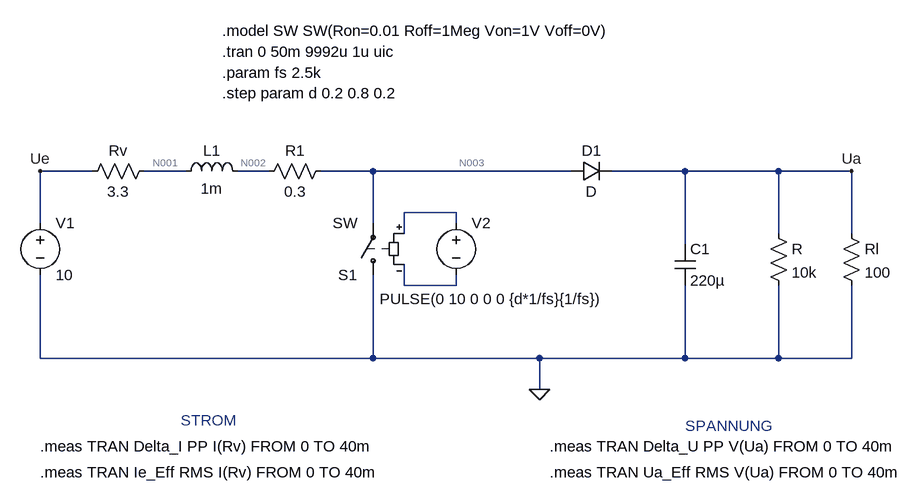
[diagram p0: schematic C4 HSS 1.asc]
C4 HSS 1.asc, the LTspice schematic file:
Version 4.1
SHEET 1 1840 920
WIRE -240 64 -320 64
WIRE -96 64 -160 64
WIRE 32 64 -16 64
WIRE 192 64 112 64
WIRE 496 64 192 64
WIRE 672 64 560 64
WIRE 816 64 672 64
WIRE 928 64 816 64
WIRE 320 128 240 128
WIRE -320 144 -320 64
WIRE 192 144 192 64
WIRE 320 144 320 128
WIRE 240 160 240 128
WIRE 816 160 816 64
WIRE 928 160 928 64
WIRE 672 176 672 64
WIRE 240 240 240 208
WIRE 320 240 320 224
WIRE 320 240 240 240
WIRE -320 352 -320 224
WIRE 192 352 192 224
WIRE 192 352 -320 352
WIRE 448 352 192 352
WIRE 672 352 672 240
WIRE 672 352 448 352
WIRE 816 352 816 240
WIRE 816 352 672 352
WIRE 928 352 928 240
WIRE 928 352 816 352
WIRE 448 400 448 352
FLAG -320 64 Ue
FLAG 928 64 Ua
FLAG 448 400 0
SYMBOL voltage -320 128 R0
SYMATTR InstName V1
SYMATTR Value 10
SYMBOL ind -112 80 R270
WINDOW 0 32 56 VTop 2
WINDOW 3 5 56 VBottom 2
SYMATTR InstName L1
SYMATTR Value 1m
SYMBOL diode 496 80 R270
WINDOW 0 32 32 VTop 2
WINDOW 3 0 32 VBottom 2
SYMATTR InstName D1
SYMBOL cap 656 176 R0
SYMATTR InstName C1
SYMATTR Value 220µ
SYMBOL res 912 144 R0
SYMATTR InstName Rl
SYMATTR Value 100
SYMBOL voltage 320 128 R0
WINDOW 3 -118 133 Left 2
SYMATTR Value PULSE(0 10 0 0 0 {d*1/fs}{1/fs})
SYMATTR InstName V2
SYMBOL sw 192 240 R180
SYMATTR InstName S1
SYMBOL res 800 144 R0
SYMATTR InstName R
SYMATTR Value 10k
SYMBOL res -144 48 R90
WINDOW 0 0 56 VBottom 2
WINDOW 3 32 56 VTop 2
SYMATTR InstName Rv
SYMATTR Value 3.3
SYMBOL res 128 48 R90
WINDOW 0 0 56 VBottom 2
WINDOW 3 32 56 VTop 2
SYMATTR InstName R1
SYMATTR Value 0.3
TEXT -40 -88 Left 2 !.param fs 2.5k
TEXT -40 -56 Left 2 !.step param d 0.2 0.8 0.2
TEXT -40 -152 Left 2 !.model SW SW(Ron=0.01 Roff=1Meg Von=1V Voff=0V)
TEXT -40 -120 Left 2 !.tran 0 50m 9992u 1u uic
TEXT -320 488 Left 2 !.meas TRAN Delta_I PP I(Rv) FROM 0 TO 40m
TEXT -320 528 Left 2 !.meas TRAN Ie_Eff RMS I(Rv) FROM 0 TO 40m
TEXT 464 488 Left 2 !.meas TRAN Delta_U PP V(Ua) FROM 0 TO 40m
TEXT 464 528 Left 2 !.meas TRAN Ua_Eff RMS V(Ua) FROM 0 TO 40m
TEXT -104 448 Left 2 ;STROM
TEXT 672 456 Left 2 ;SPANNUNG

The netlist it stands for:
* C4 HSS 1.asc
V1 Ue 0 10
L1 N001 N002 1m
D1 N003 Ua D
C1 Ua 0 220µ
Rl Ua 0 100
V2 N004 N005 PULSE(0 10 0 0 0 {d*1/fs}{1/fs})
S1 0 N003 N004 N005 SW
R Ua 0 10k
Rv N001 Ue 3.3
R1 N003 N002 0.3
.model D D
.lib standard.dio
.param fs 2.5k
.step param d 0.2 0.8 0.2
.model SW SW(Ron=0.01 Roff=1Meg Von=1V Voff=0V)
.tran 0 50m 9992u 1u uic
.meas TRAN Delta_I PP I(Rv) FROM 0 TO 40m
.meas TRAN Ie_Eff RMS I(Rv) FROM 0 TO 40m
.meas TRAN Delta_U PP V(Ua) FROM 0 TO 40m
.meas TRAN Ua_Eff RMS V(Ua) FROM 0 TO 40m
* STROM
* SPANNUNG
.backanno
.end

* Results of the author's LTspice run, read from the files saved beside the schematic
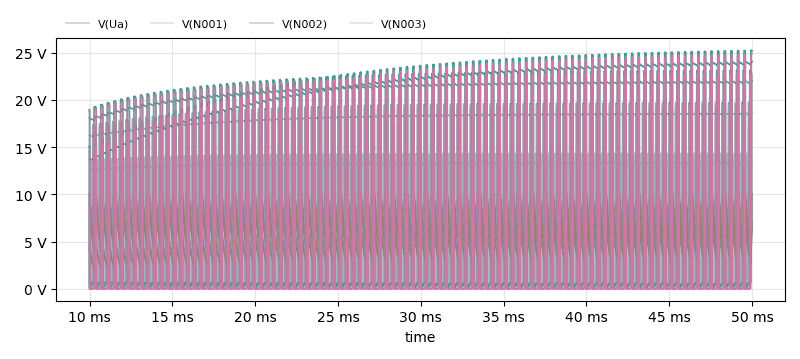
[diagram p1: Transient Analysis of C4 HSS 1.asc, plotted from the saved traces]
* Transient Analysis, 4 runs:
*   V(Ua) [d=0.2]: min 12.56 V, max 13.42 V, average 13.24 V, rms 13.24 V, last 13.31 V
*   V(Ua) [d=0.4]: min 16.09 V, max 18.68 V, average 18.1 V, rms 18.11 V, last 18.59 V
*   V(Ua) [d=0.6]: min 17.82 V, max 22.03 V, average 21.12 V, rms 21.14 V, last 22.01 V
*   V(Ua) [d=0.8]: min 13.54 V, max 24.07 V, average 21.16 V, rms 21.34 V, last 24.07 V
*   V(N001) [d=0.2]: min 7.342 V, max 10 V, average 9.211 V, rms 9.253 V, last 10 V
*   V(N001) [d=0.4]: min 5.459 V, max 10 V, average 8.149 V, rms 8.293 V, last 10 V
*   V(N001) [d=0.6]: min 4 V, max 10 V, average 6.974 V, rms 7.189 V, last 10 V
*   V(N001) [d=0.8]: min 1.922 V, max 7.038 V, average 4.123 V, rms 4.302 V, last 7.023 V
*   V(N002) [d=0.2]: min 1.342 mV, max 14.33 V, average 9.211 V, rms 10.67 V, last 10 V
*   V(N002) [d=0.4]: min 2.712 mV, max 19.69 V, average 8.148 V, rms 11.57 V, last 10 V
*   V(N002) [d=0.6]: min 2.712 mV, max 23.1 V, average 6.979 V, rms 12.1 V, last 10 V
*   V(N002) [d=0.8]: min 278.2 mV, max 25.23 V, average 4.139 V, rms 9.18 V, last 25.17 V
*   V(N003) [d=0.2]: min 52.6 µV, max 14.21 V, average 9.139 V, rms 10.62 V, last 10 V
*   V(N003) [d=0.4]: min 105.7 µV, max 19.48 V, average 7.98 V, rms 11.47 V, last 10 V
*   V(N003) [d=0.6]: min 105.5 µV, max 22.84 V, average 6.704 V, rms 11.96 V, last 10 V
*   V(N003) [d=0.8]: min 8.976 mV, max 24.9 V, average 3.604 V, rms 8.968 V, last 24.9 V
* From the log:
*   Measurement: delta_i
*     step  PP(I(Rv))  FROM  TO
*        1  0.80534661017  0  0.04
*        2  1.37615687341  0  0.04
*        3  1.81803749627  0  0.04
*        4  1.55024671555  0  0.04
*   Measurement: ie_eff
*     step  RMS(I(Rv))  FROM  TO
*        1  0.356353469929  0  0.04
*        2  0.726708955901  0  0.04
*        3  1.05572073432  0  0.04
*        4  1.81781272077  0  0.04
*   Measurement: delta_u
*     step  PP(V(Ua))  FROM  TO
*        1  0.863597869873  0  0.04
*        2  2.59478187561  0  0.04
*        3  4.21078872681  0  0.04
*        4  10.5201816559  0  0.04
*   Measurement: ua_eff
*     step  RMS(V(Ua))  FROM  TO
*        1  13.2385050753  0  0.04
*        2  18.1120230414  0  0.04
*        3  21.1384423804  0  0.04
*        4  21.3406499904  0  0.04